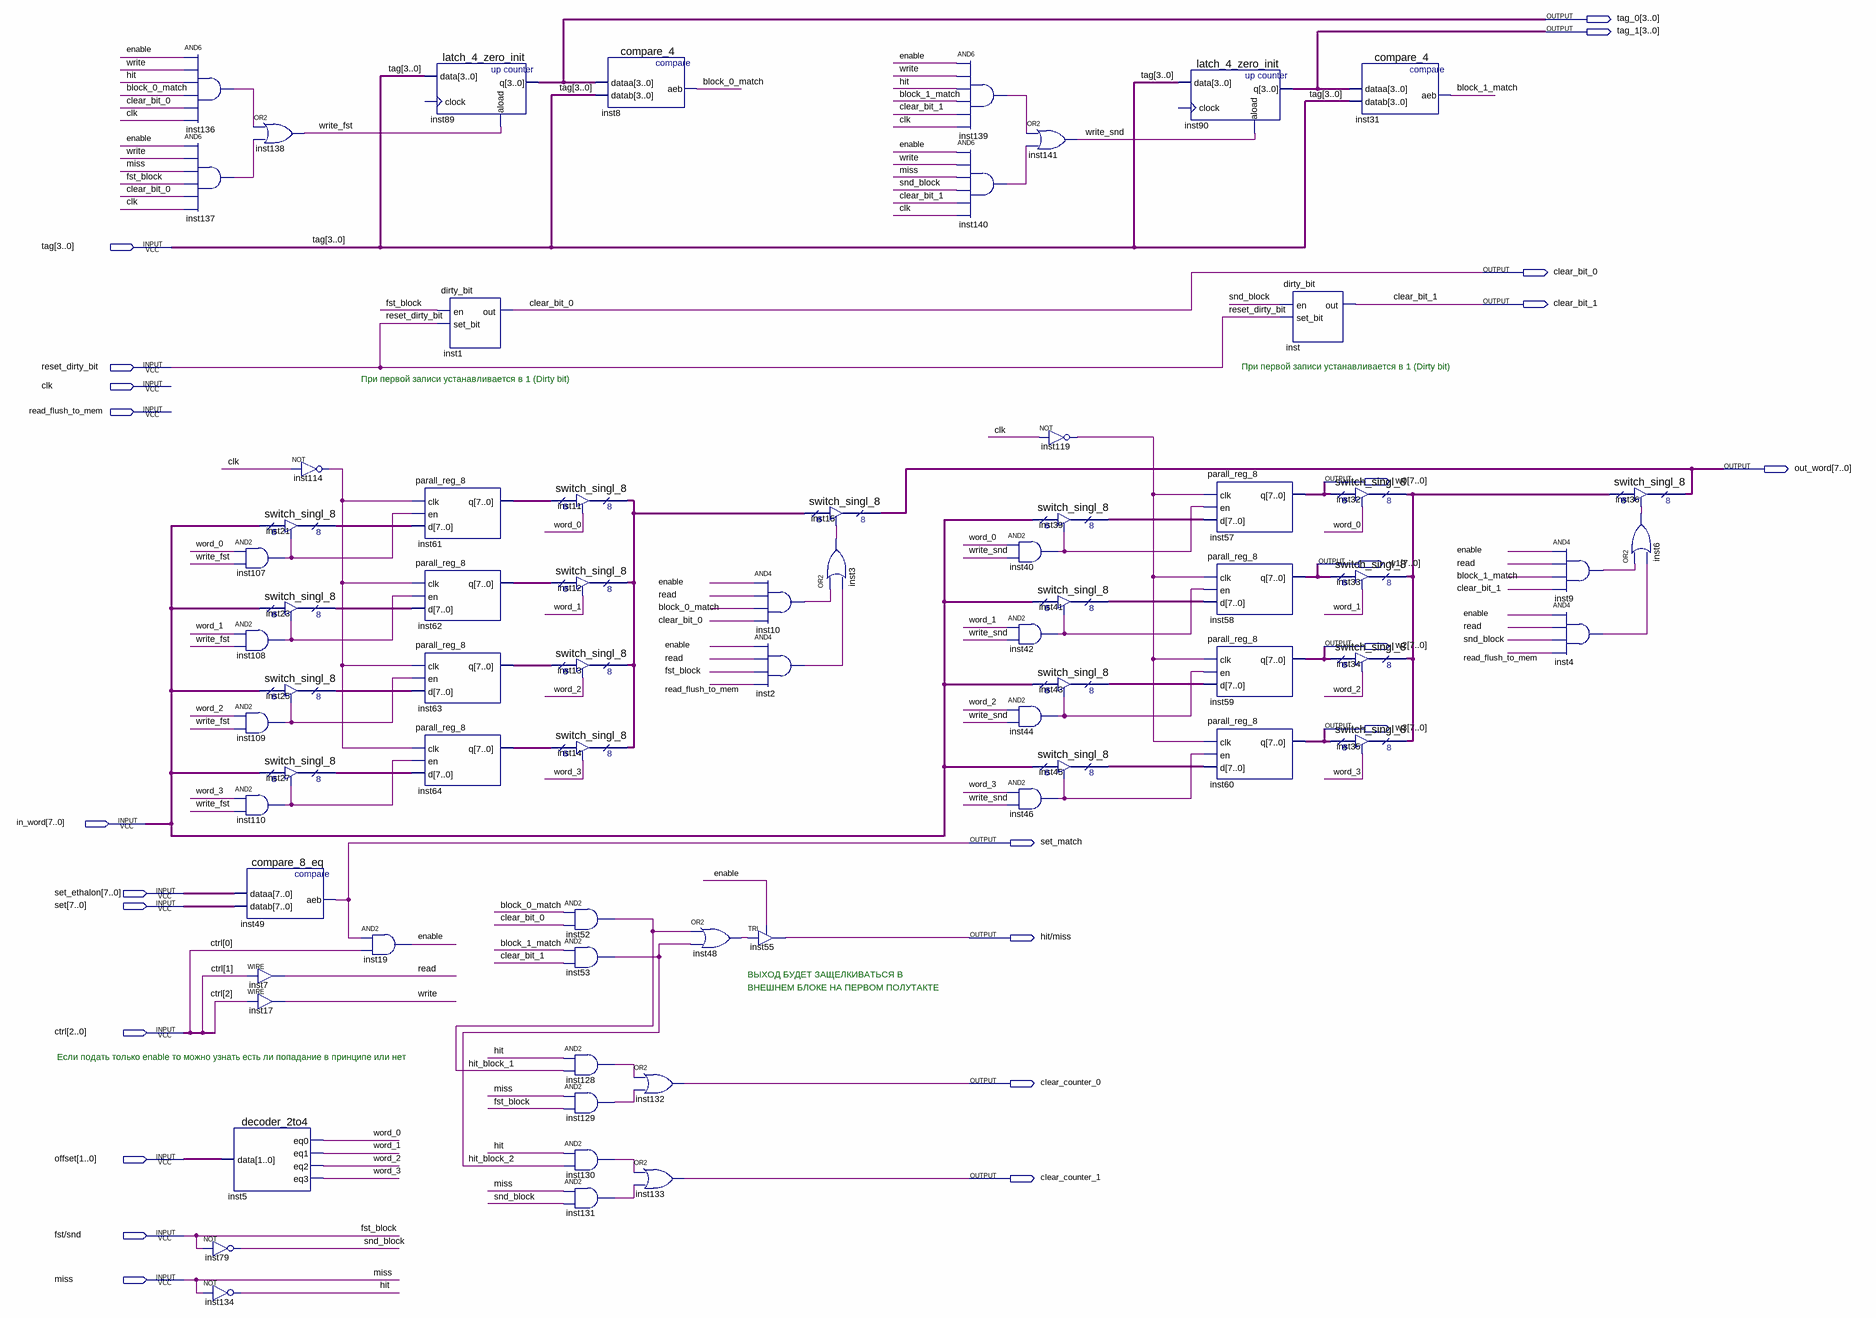
[diagram p0: schematic sheet]
// Quartus schematic cache_row.bdf as structural Verilog: 71 symbols, 24 pins
module cache_row (
  input  [3:0] tag,
  input  reset_dirty_bit,
  input  clk,
  input  read_flush_to_mem,
  input  [7:0] in_word,
  input  [7:0] set_ethalon,
  input  [7:0] set,
  input  [2:0] ctrl,
  input  [1:0] offset,
  input  \fst/snd ,
  input  miss,
  output [3:0] tag_0,
  output [3:0] tag_1,
  output clear_bit_0,
  output clear_bit_1,
  output [7:0] out_word,
  output [7:0] w0,
  output [7:0] w1,
  output [7:0] w2,
  output [7:0] w3,
  output set_match,
  output \hit/miss ,
  output clear_counter_0,
  output clear_counter_1
);

  wire block_0_match, block_1_match, enable, hit, hit_block_1, hit_block_2, inst2_out, inst3_out, inst4_out,
       inst6_out, inst9_out, inst10_out, inst40_out, inst42_out, inst44_out, inst46_out, inst48_out,
       inst107_out, inst108_out, inst109_out, inst110_out, inst114_out, inst119_out, inst128_out,
       inst129_out, inst130_out, inst131_out, inst136_out, inst137_out, inst139_out, inst140_out, read,
       snd_block, word_0, word_1, word_2, word_3, write, write_fst, write_snd;
  wire [7:0] inst11_tridata, inst21_tridata, inst23_tridata, inst25_tridata, inst27_tridata, inst32_tridata,
       inst39_tridata, inst41_tridata, inst43_tridata, inst45_tridata, inst61_q, inst62_q, inst63_q, inst64_q;

  and inst136 (inst136_out, enable, write, hit, block_0_match, clear_bit_0, clk);
  and inst137 (inst137_out, enable, write, miss, \fst/snd , clear_bit_0, clk);
  not inst79 (snd_block, \fst/snd );
  not inst134 (hit, miss);
  or inst138 (write_fst, inst136_out, inst137_out);
  and inst107 (inst107_out, word_0, write_fst);
  and inst108 (inst108_out, word_1, write_fst);
  and inst109 (inst109_out, word_2, write_fst);
  and inst110 (inst110_out, word_3, write_fst);
  compare_8_eq inst49 (.dataa(set_ethalon), .datab(set), .aeb(set_match));
  assign read = ctrl[1];  // WIRE inst7
  assign write = ctrl[2];  // WIRE inst17
  decoder_2to4 inst5 (.data(offset), .eq0(word_0), .eq1(word_1), .eq2(word_2), .eq3(word_3));
  not inst114 (inst114_out, clk);
  switch_singl_8 inst21 (.enabledt(inst107_out), .data(in_word), .tridata(inst21_tridata));
  switch_singl_8 inst23 (.enabledt(inst108_out), .data(in_word), .tridata(inst23_tridata));
  switch_singl_8 inst25 (.enabledt(inst109_out), .data(in_word), .tridata(inst25_tridata));
  switch_singl_8 inst27 (.enabledt(inst110_out), .data(in_word), .tridata(inst27_tridata));
  and inst19 (enable, set_match, ctrl[0]);
  latch_4_zero_init inst89 (.data(tag), .aload(write_fst), .q(tag_0));  // open: clock
  dirty_bit inst1 (.en(\fst/snd ), .set_bit(reset_dirty_bit), .out(clear_bit_0));
  parall_reg_8 inst61 (.clk(inst114_out), .en(inst107_out), .d(inst21_tridata), .q(inst61_q));
  parall_reg_8 inst62 (.clk(inst114_out), .en(inst108_out), .d(inst23_tridata), .q(inst62_q));
  parall_reg_8 inst63 (.clk(inst114_out), .en(inst109_out), .d(inst25_tridata), .q(inst63_q));
  parall_reg_8 inst64 (.clk(inst114_out), .en(inst110_out), .d(inst27_tridata), .q(inst64_q));
  switch_singl_8 inst11 (.enabledt(word_0), .data(inst61_q), .tridata(inst11_tridata));
  switch_singl_8 inst12 (.enabledt(word_1), .data(inst62_q), .tridata(inst11_tridata));
  switch_singl_8 inst13 (.enabledt(word_2), .data(inst63_q), .tridata(inst11_tridata));
  switch_singl_8 inst14 (.enabledt(word_3), .data(inst64_q), .tridata(inst11_tridata));
  compare_4 inst8 (.dataa(tag_0), .datab(tag), .aeb(block_0_match));
  and inst52 (hit_block_1, block_0_match, clear_bit_0);
  and inst53 (hit_block_2, block_1_match, clear_bit_1);
  and inst128 (inst128_out, hit, hit_block_1);
  and inst129 (inst129_out, miss, \fst/snd );
  and inst130 (inst130_out, hit, hit_block_2);
  and inst131 (inst131_out, miss, snd_block);
  or inst132 (clear_counter_0, inst128_out, inst129_out);
  or inst133 (clear_counter_1, inst130_out, inst131_out);
  or inst48 (inst48_out, hit_block_1, hit_block_2);
  and inst10 (inst10_out, enable, read, block_0_match, clear_bit_0);
  and inst2 (inst2_out, enable, read, \fst/snd , read_flush_to_mem);
  TRI inst55 (.IN(inst48_out), .OE(enable), .OUT(\hit/miss ));
  switch_singl_8 inst15 (.enabledt(inst3_out), .data(inst11_tridata), .tridata(out_word));
  or inst3 (inst3_out, inst10_out, inst2_out);
  and inst139 (inst139_out, enable, write, hit, block_1_match, clear_bit_1, clk);
  and inst140 (inst140_out, enable, write, miss, snd_block, clear_bit_1, clk);
  and inst40 (inst40_out, word_0, write_snd);
  and inst42 (inst42_out, word_1, write_snd);
  and inst44 (inst44_out, word_2, write_snd);
  and inst46 (inst46_out, word_3, write_snd);
  or inst141 (write_snd, inst139_out, inst140_out);
  not inst119 (inst119_out, clk);
  switch_singl_8 inst39 (.enabledt(inst40_out), .data(in_word), .tridata(inst39_tridata));
  switch_singl_8 inst41 (.enabledt(inst42_out), .data(in_word), .tridata(inst41_tridata));
  switch_singl_8 inst43 (.enabledt(inst44_out), .data(in_word), .tridata(inst43_tridata));
  switch_singl_8 inst45 (.enabledt(inst46_out), .data(in_word), .tridata(inst45_tridata));
  latch_4_zero_init inst90 (.data(tag), .aload(write_snd), .q(tag_1));  // open: clock
  parall_reg_8 inst57 (.clk(inst119_out), .en(inst40_out), .d(inst39_tridata), .q(w0));
  parall_reg_8 inst58 (.clk(inst119_out), .en(inst42_out), .d(inst41_tridata), .q(w1));
  parall_reg_8 inst59 (.clk(inst119_out), .en(inst44_out), .d(inst43_tridata), .q(w2));
  parall_reg_8 inst60 (.clk(inst119_out), .en(inst46_out), .d(inst45_tridata), .q(w3));
  dirty_bit inst (.en(snd_block), .set_bit(reset_dirty_bit), .out(clear_bit_1));
  compare_4 inst31 (.dataa(tag_1), .datab(tag), .aeb(block_1_match));
  switch_singl_8 inst32 (.enabledt(word_0), .data(w0), .tridata(inst32_tridata));
  switch_singl_8 inst33 (.enabledt(word_1), .data(w1), .tridata(inst32_tridata));
  switch_singl_8 inst34 (.enabledt(word_2), .data(w2), .tridata(inst32_tridata));
  switch_singl_8 inst35 (.enabledt(word_3), .data(w3), .tridata(inst32_tridata));
  and inst9 (inst9_out, enable, read, block_1_match, clear_bit_1);
  and inst4 (inst4_out, enable, read, snd_block, read_flush_to_mem);
  switch_singl_8 inst36 (.enabledt(inst6_out), .data(inst32_tridata), .tridata(out_word));
  or inst6 (inst6_out, inst9_out, inst4_out);

  // Other names for the same wires on the sheet: fst_block = \fst/snd 

  // Notes on the sheet:
  //   При первой записи устанавливается в 1 (Dirty bit)
  //   При первой записи устанавливается в 1 (Dirty bit)
  //   ВЫХОД БУДЕТ ЗАЩЕЛКИВАТЬСЯ В
  //   ВНЕШНЕМ БЛОКЕ НА ПЕРВОМ ПОЛУТАКТЕ
  //   Если подать только enable то можно узнать есть ли попадание в принципе или нет
endmodule
